# Altium schematic sheet CurrentSense.SchDoc
size A4
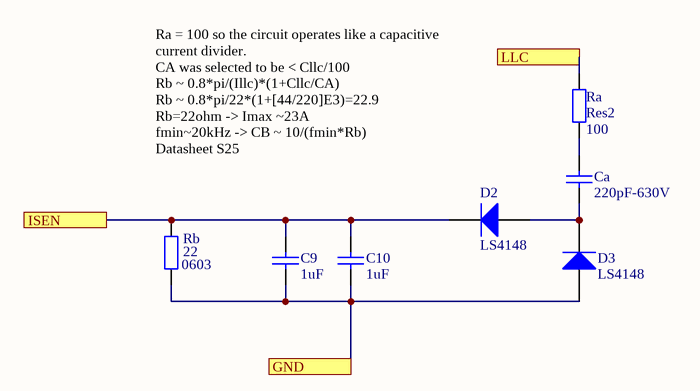
[diagram p0: CurrentSense.SchDoc]

## Parts
C9  value 1uF  [1608[0603]]  (hidden comment: Cap)
C10  value 1uF  [1608[0603]]  (hidden comment: Cap)
Ca  value 220pF-630V  [1812]  (hidden comment: Cap)
D2  LS4148  [SOD-80]
D3  LS4148  [SOD-80]
Ra  Res2  value 100  [C1206]
Rb  0603  value 22  [1608[0603]]

## Ports
GND, ISEN, LLC

## Nets
GND: C9.1 C10.1 D3.1(A) Rb.1 ; port GND
ISEN: C9.2 C10.2 D2.2(K) Rb.2 ; port ISEN
LLC: Ra.2 ; port LLC
NetCa_1: Ca.1 D2.1(A) D3.2(K)
NetCa_2: Ca.2 Ra.1

## Notes on the sheet
- Ra = 100 so the circuit operates like a capacitive current divider.
  CA was selected to be < Cllc/100
  Rb ~ 0.8*pi/(Illc)*(1+Cllc/CA)
  Rb ~ 0.8*pi/22*(1+[44/220]E3)=22.9
  Rb=22ohm -> Imax ~23A
  fmin~20kHz -> CB ~ 10/(fmin*Rb)
  Datasheet S25

## Library data of the parts
C9 C10 Ca = Cap: Capacitor; Published: 8-Jun-2000; LatestRevisionDate: 17-Jul-2002; LatestRevisionNote: Re-released for DXP Platform.; PackageReference: RAD-0.3; Publisher: Altium Limited; PackageDescription: Radial Cap, Thru-Hole; 2 Leads; 0.3 in Pin Spacing
  C9 C10: Supplier 1: Mouser; Supplier Part Number 1: 710-885012106017
  Ca: Supplier 1: Digi-Key; Supplier Part Number 1: 478-1138-6-ND
D2 D3 = Diode: Default Diode; Published: 8-Jun-2000; LatestRevisionDate: 17-Jul-2002; LatestRevisionNote: Re-released for DXP Platform.; PackageVersion: Sep-1996; PackageReference: SMC; Publisher: Altium Limited; PackageDescription: DO-214-AB/SMC; 2 C-Bend Leads; Body 7.9 x 5.9 mm, inc. leads (LxW); Code_JEDEC: DO-214-AB
Ra Rb = Res2: Resistor; Published: 8-Jun-2000; LatestRevisionDate: 17-Jul-2002; LatestRevisionNote: Re-released for DXP Platform.; PackageReference: AXIAL-0.4; Publisher: Altium Limited; PackageDescription: Axial Device, Thru-Hole; 2 Leads; 0.4 in Pin Spacing; Supplier 1: Digi-Key; Supplier Part Number 1: 541-220KFDKR-ND